# Altium schematic sheet HANDS_FREE_ControlUnit_V2.SchDoc
size A1
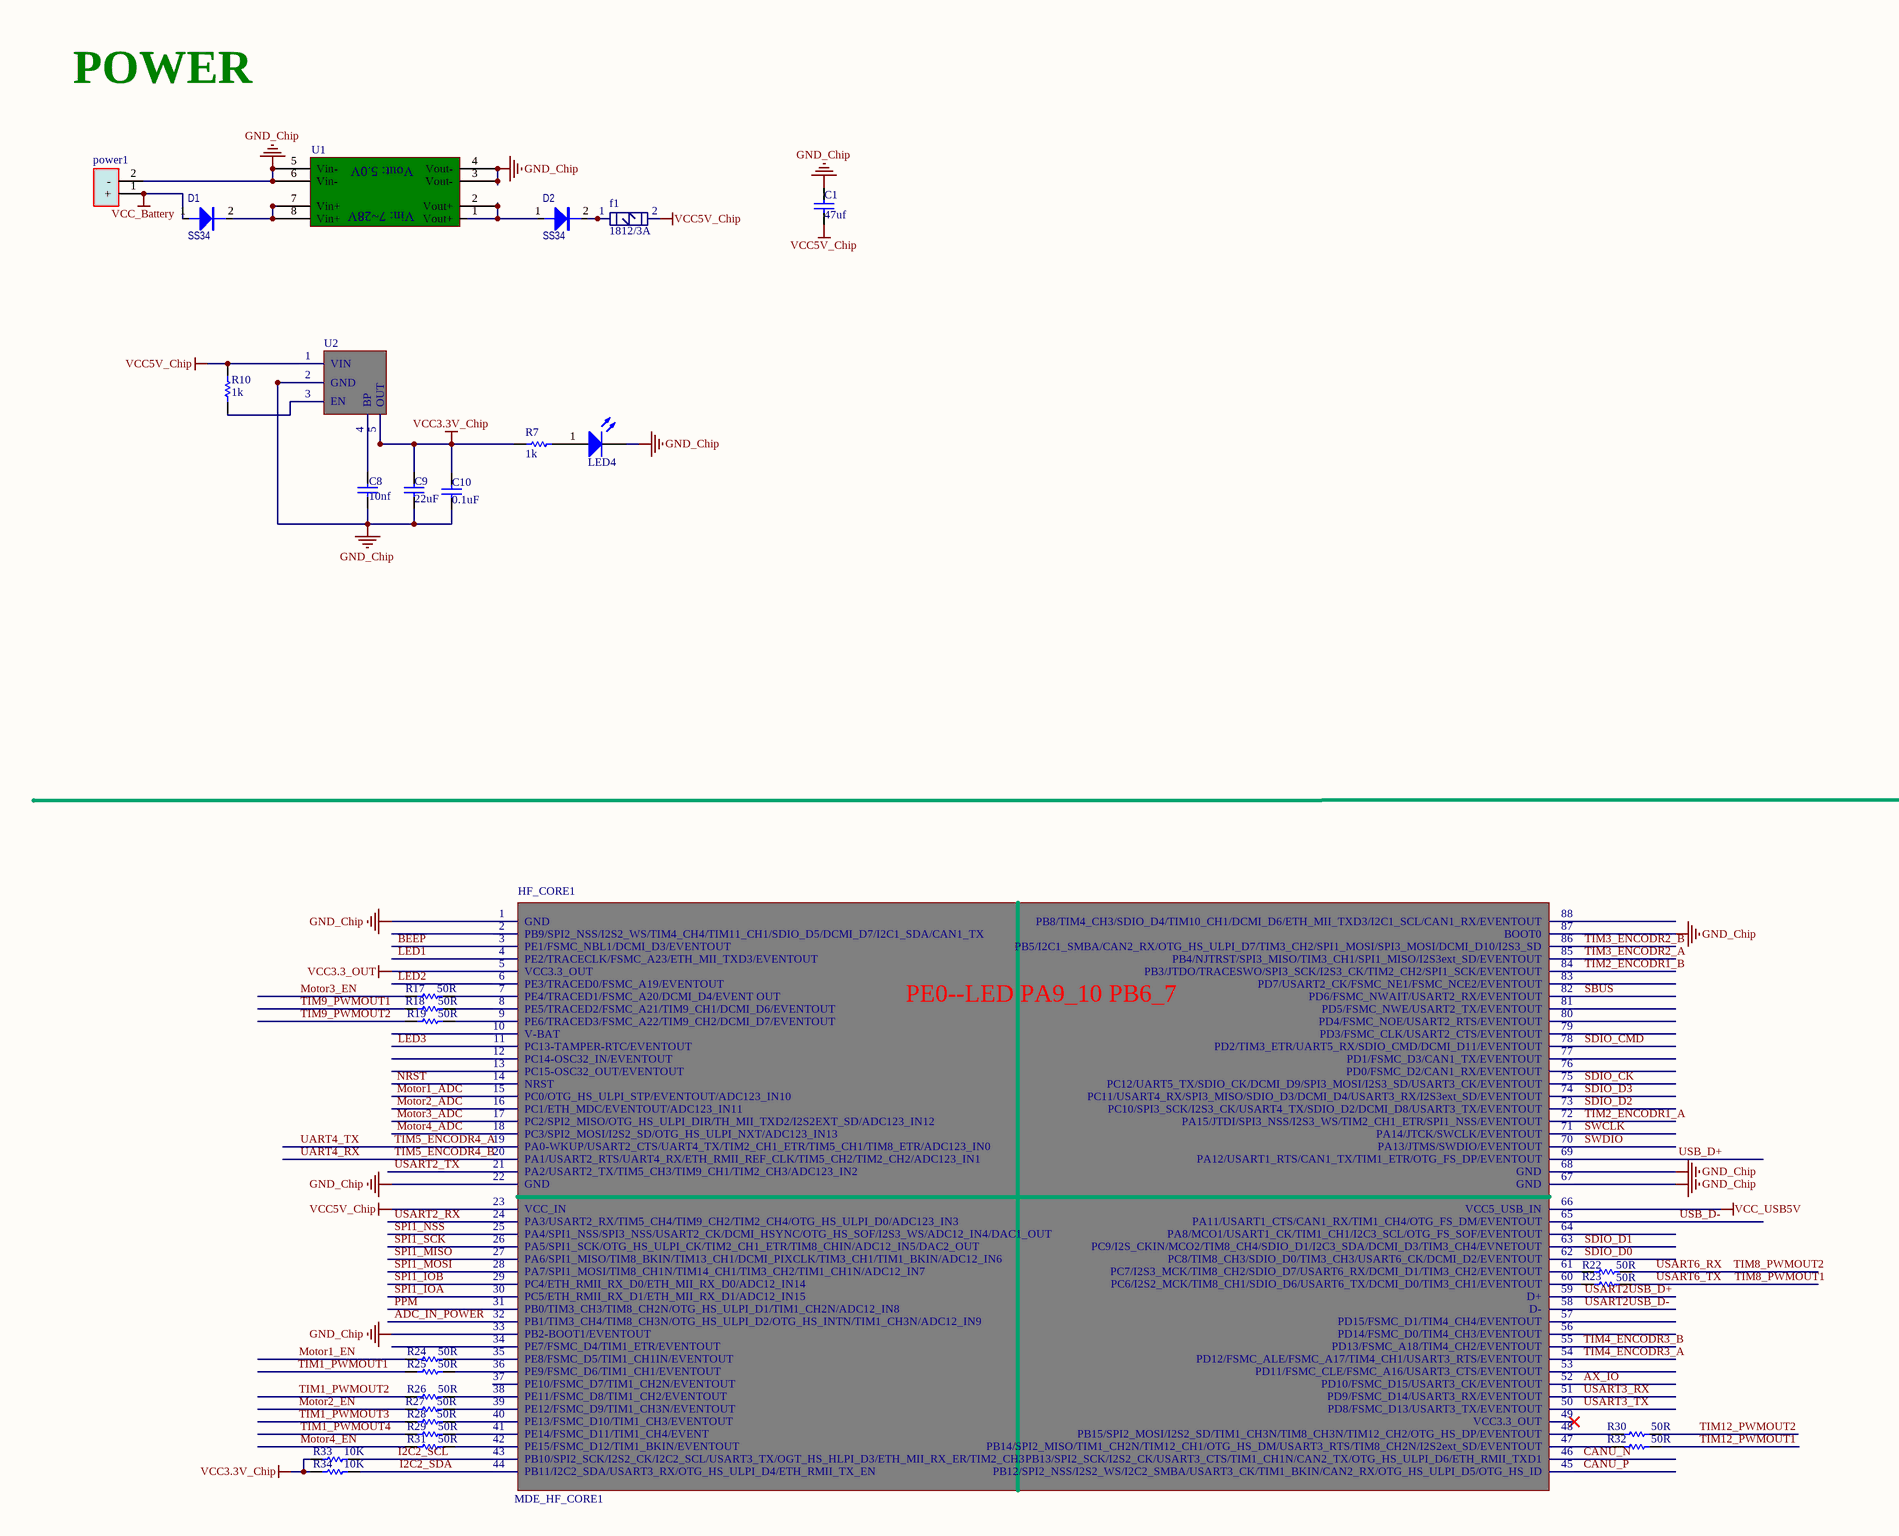
[diagram p0: HANDS_FREE_ControlUnit_V2.SchDoc, top left]
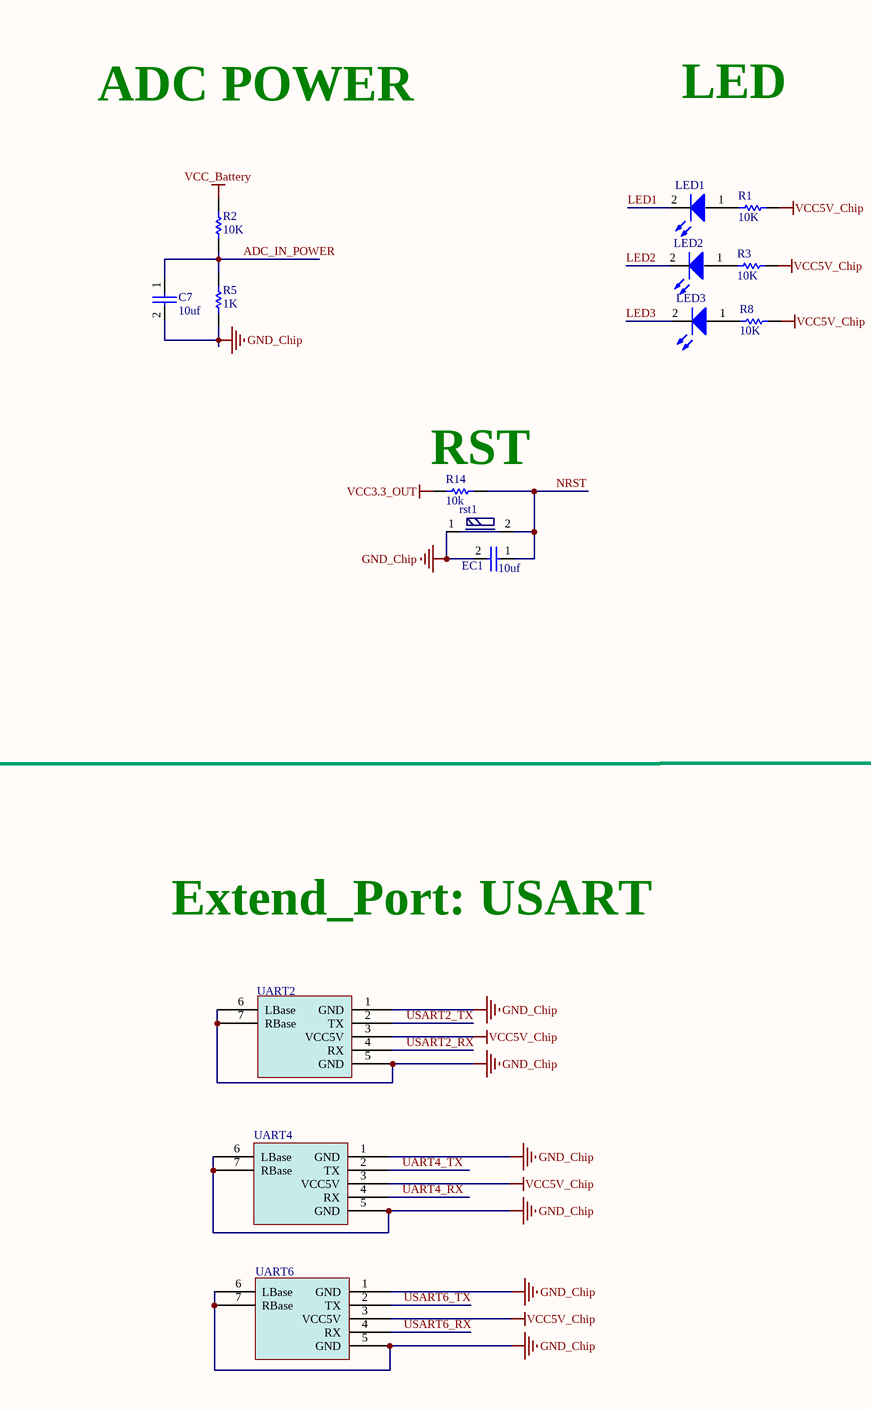
[diagram p1: HANDS_FREE_ControlUnit_V2.SchDoc, top middle]
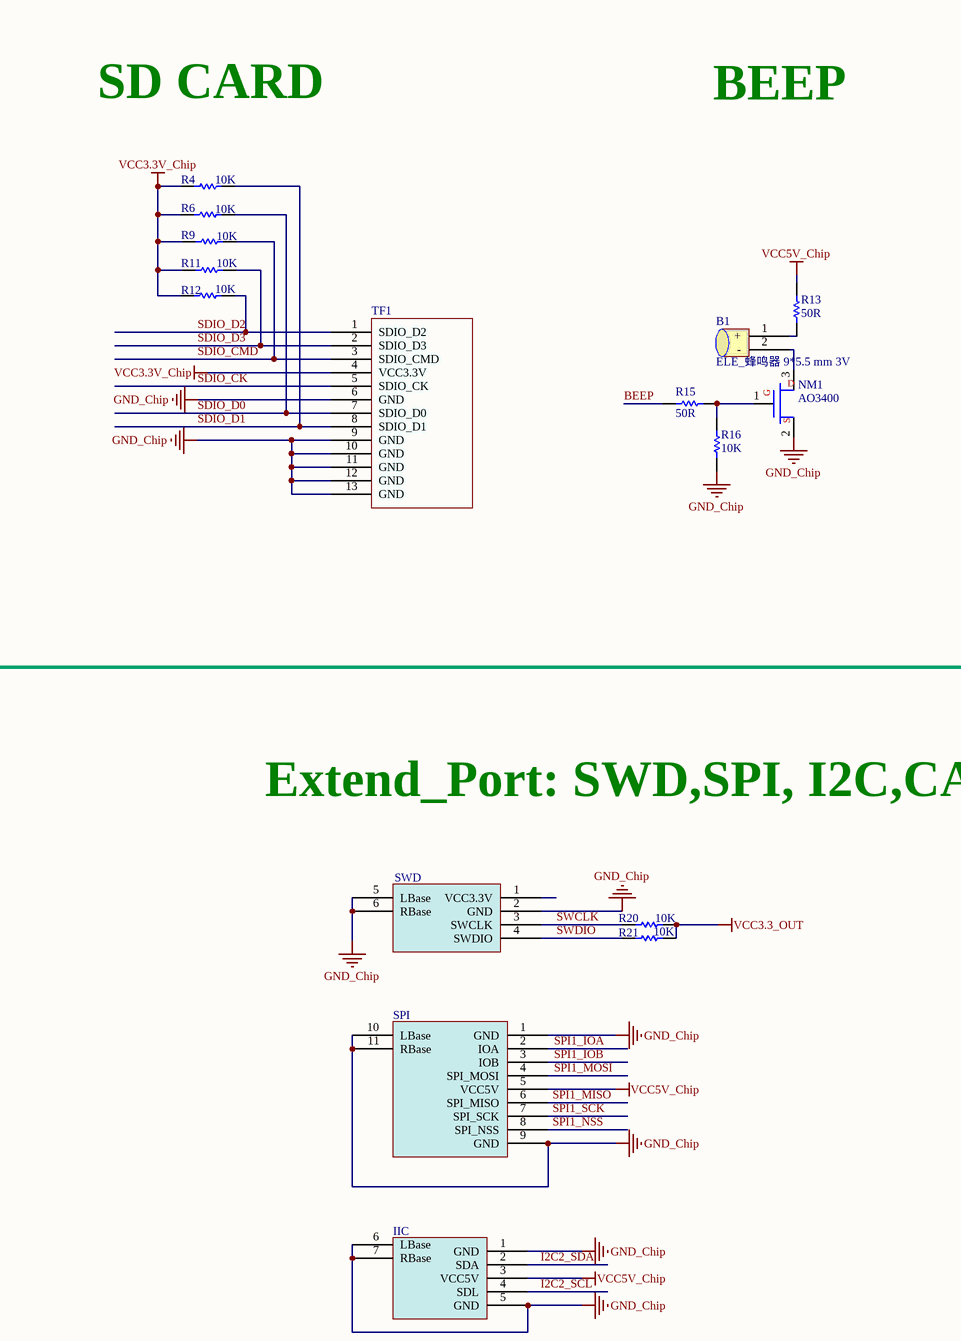
[diagram p2: HANDS_FREE_ControlUnit_V2.SchDoc, top right]
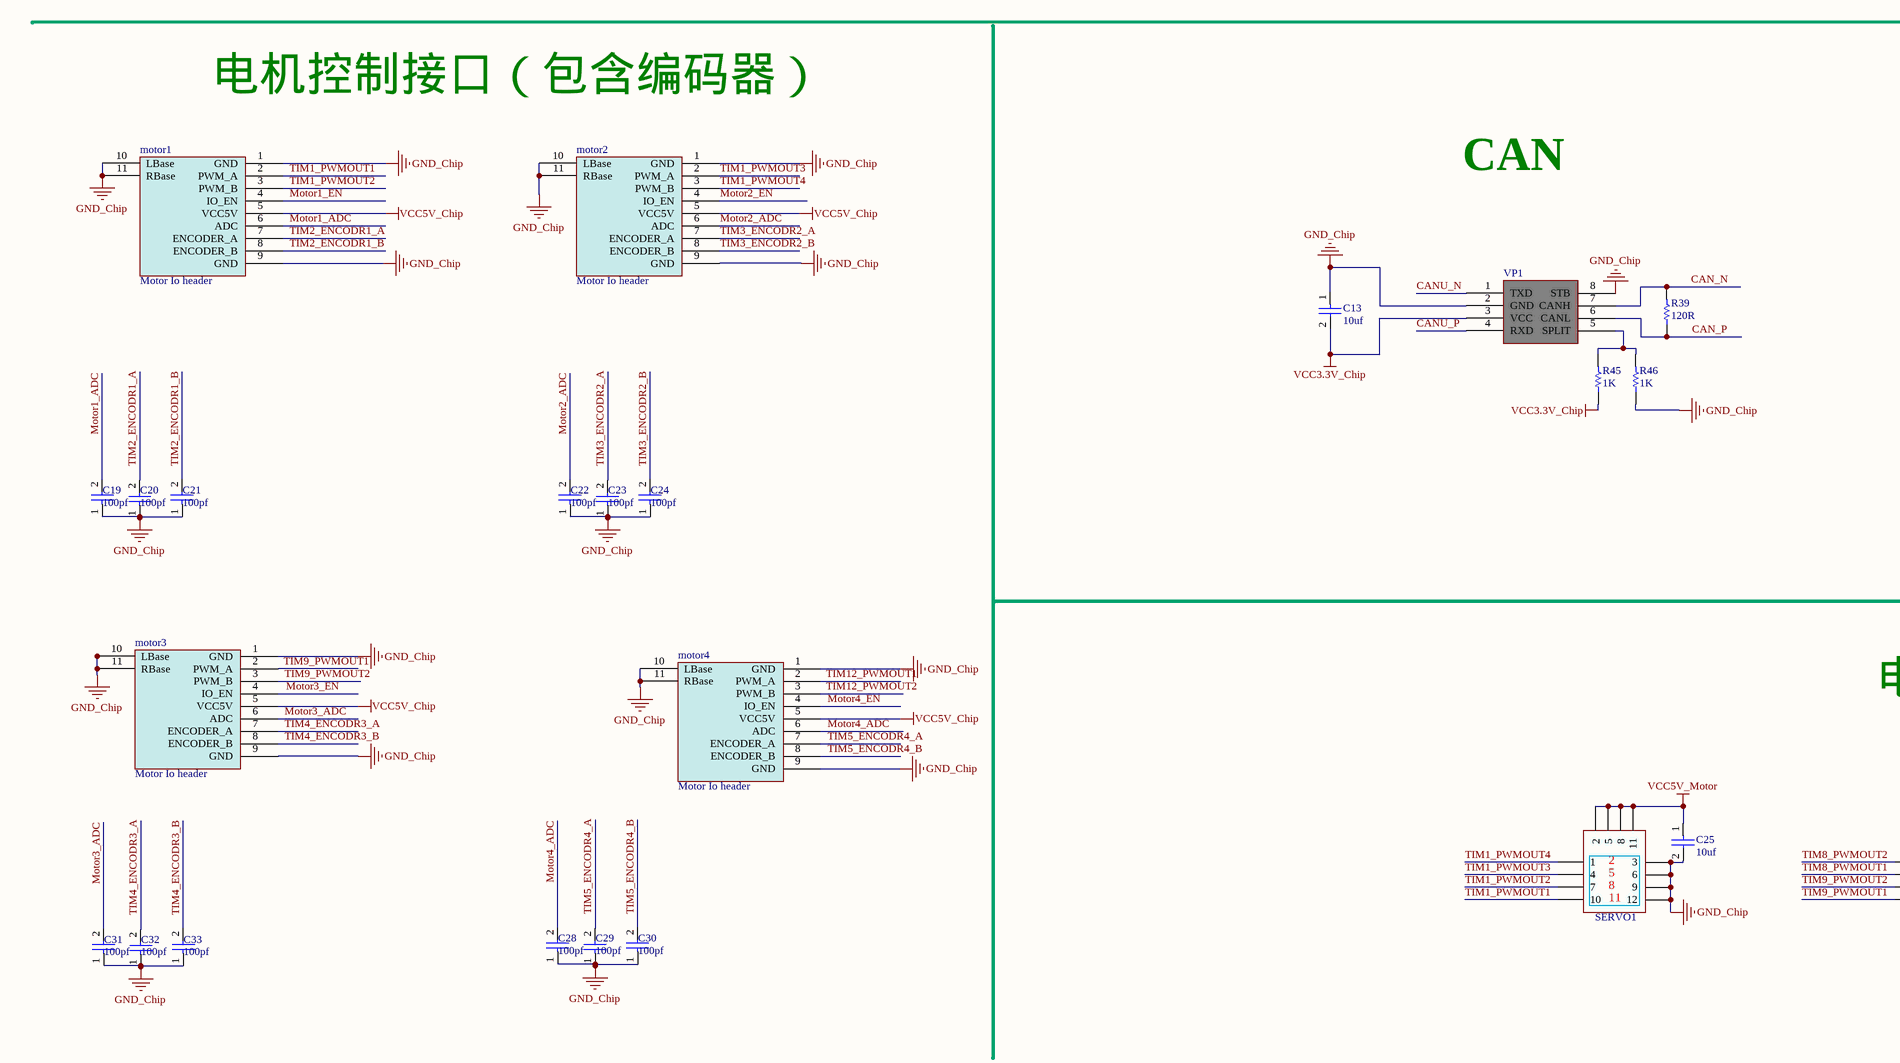
[diagram p3: HANDS_FREE_ControlUnit_V2.SchDoc, bottom left]
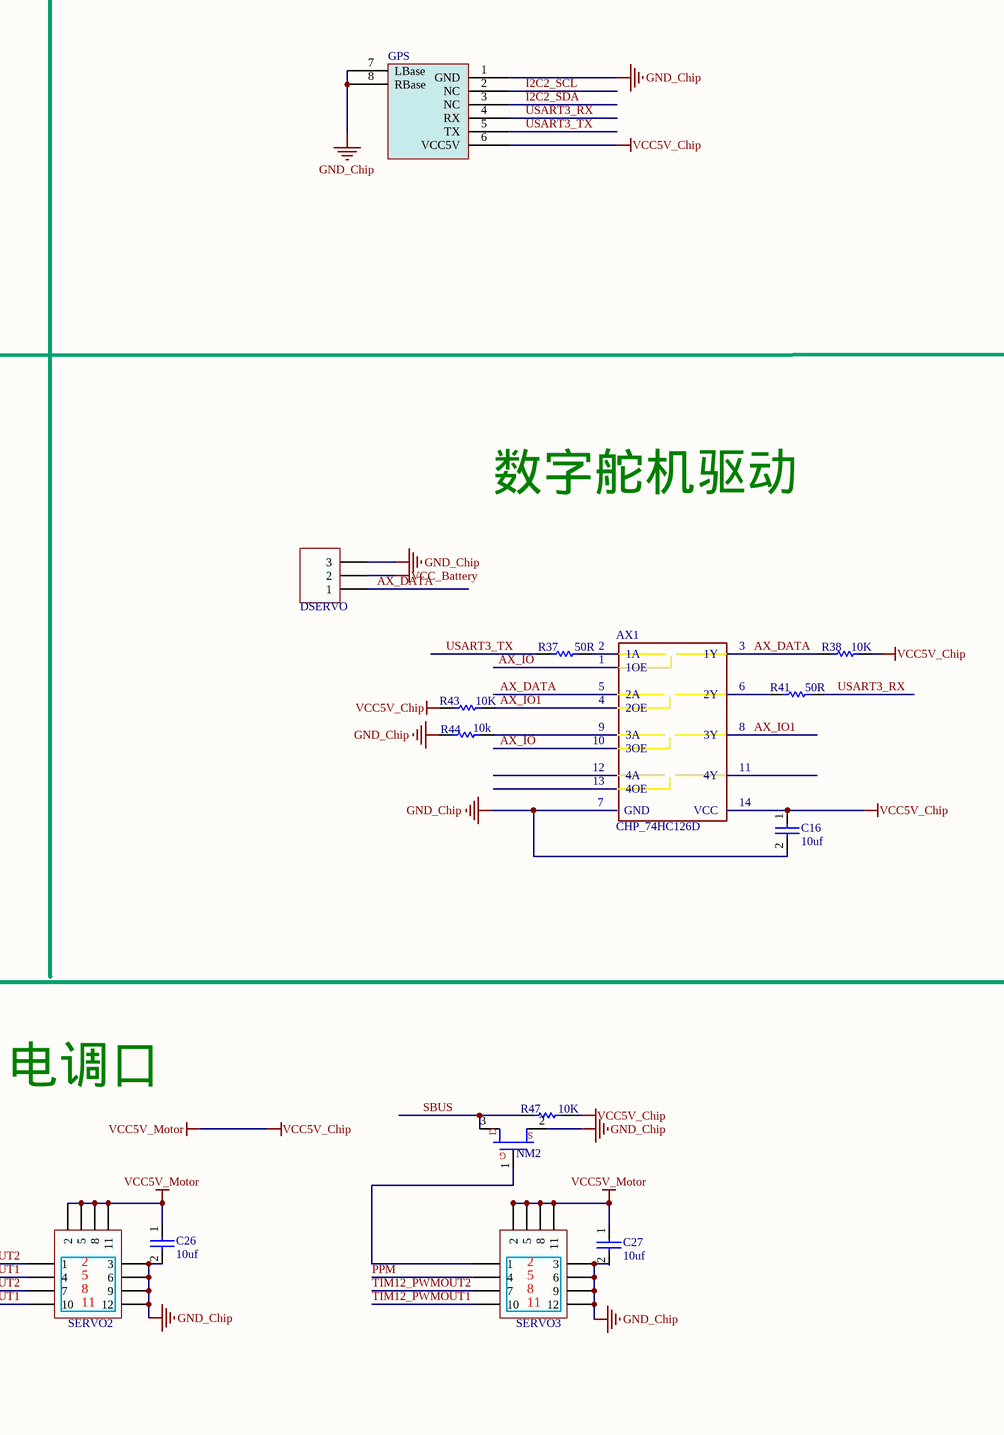
[diagram p4: HANDS_FREE_ControlUnit_V2.SchDoc, bottom middle]
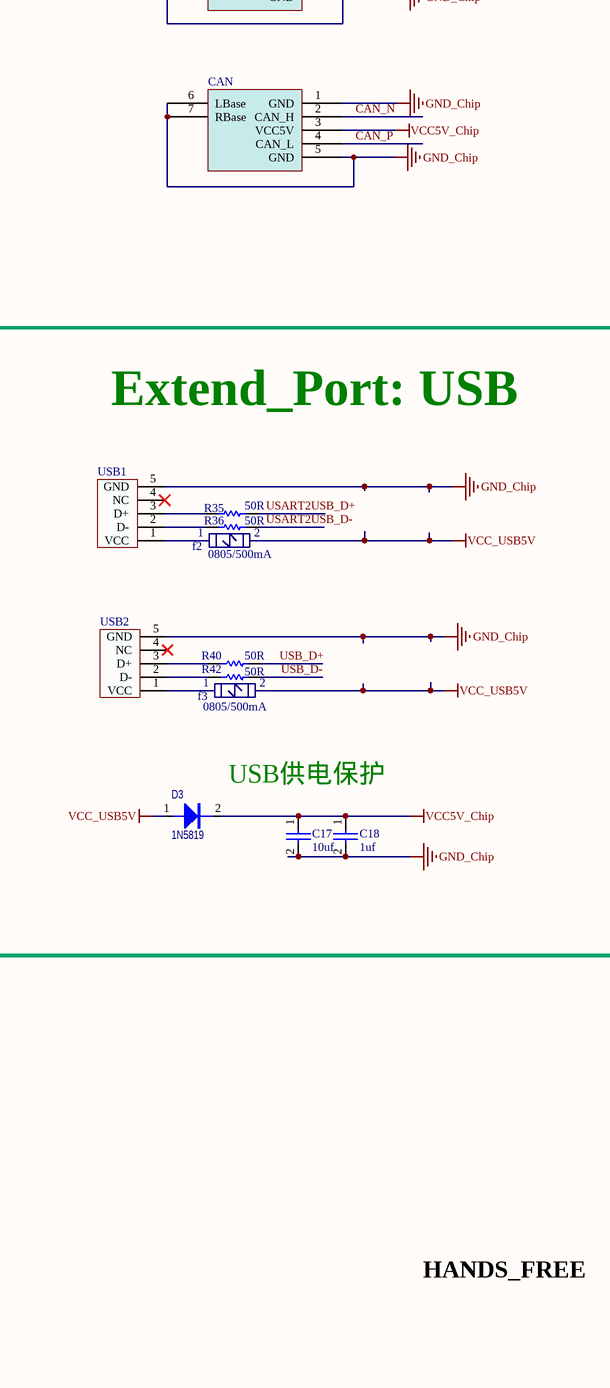
[diagram p5: HANDS_FREE_ControlUnit_V2.SchDoc, bottom right]

## Parts
AX1  CHP_74HC126D  [CHP_SOP_14P]
B1  ELE_蜂鸣器 9*5.5 mm 3V  [ELE_蜂鸣器_D_9*5.5]
C1  47uf  [ELE_1206_P]
C7  10uf  [ELE_0603_P]
C8  10nf  [ELE_0603_P]
C9  22uF  [ELE_0603_P]
C10  0.1uF  [ELE_0603_P]
C13  10uf  [ELE_0603_P]
C16  10uf  [ELE_0603_P]
C17  10uf  [ELE_0603_P]
C18  1uf  [ELE_0603_P]
C19  100pf  [ELE_0603_P]
C20  100pf  [ELE_0603_P]
C21  100pf  [ELE_0603_P]
C22  100pf  [ELE_0603_P]
C23  100pf  [ELE_0603_P]
C24  100pf  [ELE_0603_P]
C25  10uf  [ELE_0603_P]
C26  10uf  [ELE_0603_P]
C27  10uf  [ELE_0603_P]
C28  100pf  [ELE_0603_P]
C29  100pf  [ELE_0603_P]
C30  100pf  [ELE_0603_P]
C31  100pf  [ELE_0603_P]
C32  100pf  [ELE_0603_P]
C33  100pf  [ELE_0603_P]
CAN  HANDS_FREE_IMU  [HDR_Molex_PH_1.25_5P]  (value not drawn)
D1  SS34  [ELE_D1206]
D2  SS34  [ELE_D1206]
D3  1N5819  [ELE_SOD-323]
DSERVO  HDR_Header_1*3  [HDR_数字舵机接口_D]  (value not drawn)
EC1  10uf  [ELE_0603_P]
f1  1812/3A  [ELE_FUZE_1812]
f2  0805/500mA  [ELE_FUZE_0805]
f3  0805/500mA  [ELE_FUZE_0805]
GPS  HANDS_FREE_GPS  [HDR_Molex_PH_1.25_6P]  (value not drawn)
HF_CORE1  MDE_HF_CORE1  [MDE_HF_CORE1]
IIC  HANDS_FREE_IIC  [HDR_Molex_PH_1.25_5P]  (value not drawn)
LED1  ELE_LED  [ELE_0603极性_P]  (value not drawn)
LED2  ELE_LED  [ELE_0603极性_P]  (value not drawn)
LED3  ELE_LED  [ELE_0603极性_P]  (value not drawn)
LED4  Led_sp  [ELE_0603极性_P]  (value not drawn)
motor1  Motor Io header  [HDR_Molex_PH_1.25_9P]
motor2  Motor Io header  [HDR_Molex_PH_1.25_9P]
motor3  Motor Io header  [HDR_Molex_PH_1.25_9P]
motor4  Motor Io header  [HDR_Molex_PH_1.25_9P]
NM1  AO3400  [CHP_SOT23_P_3P]
NM2  AO3400  [CHP_SOT23_P_3P]  (value not drawn)
power1  HDR_Header_Power_2P  [HDR_MOLEX_CANMX3.0_DH_2P]  (value not drawn)
R1  10K  [ELE_0603_P]
R2  10K  [ELE_0603_P]
R3  10K  [ELE_0603_P]
R4  10K  [ELE_0603_P]
R5  1K  [ELE_0603_P]
R6  10K  [ELE_0603_P]
R7  1k  [ELE_0603_P]
R8  10K  [ELE_0603_P]
R9  10K  [ELE_0603_P]
R10  1k  [ELE_0603_P]
R11  10K  [ELE_0603_P]
R12  10K  [ELE_0603_P]
R13  50R  [ELE_0603_P]
R14  10k  [ELE_0603_P]
R15  50R  [ELE_0603_P]
R16  10K  [ELE_0603_P]
R17  50R  [ELE_0603_P]
R18  50R  [ELE_0603_P]
R19  50R  [ELE_0603_P]
R20  10K  [ELE_0603_P]
R21  10K  [ELE_0603_P]
R22  50R  [ELE_0603_P]
R23  50R  [ELE_0603_P]
R24  50R  [ELE_0603_P]
R25  50R  [ELE_0603_P]
R26  50R  [ELE_0603_P]
R27  50R  [ELE_0603_P]
R28  50R  [ELE_0603_P]
R29  50R  [ELE_0603_P]
R30  50R  [ELE_0603_P]
R31  50R  [ELE_0603_P]
R32  50R  [ELE_0603_P]
R33  10K  [ELE_0603_P]
R34  10K  [ELE_0603_P]
R35  50R  [ELE_0603_P]
R36  50R  [ELE_0603_P]
R37  50R  [ELE_0603_P]
R38  10K  [ELE_0603_P]
R39  120R  [ELE_0603_P]
R40  50R  [ELE_0603_P]
R41  50R  [ELE_0603_P]
R42  50R  [ELE_0603_P]
R43  10K  [ELE_0603_P]
R44  10k  [ELE_0603_P]
R45  1K  [ELE_0603_P]
R46  1K  [ELE_0603_P]
R47  10K  [ELE_0603_P]
rst1  ELE_KEY_1  [ELE_KEY_P]  (value not drawn)
SERVO1  HDR_Header_4*3  [HDR_Header_2.54/3.0_DV_3*4]  (value not drawn)
SERVO2  HDR_Header_4*3  [HDR_Header_2.54/3.0_DV_3*4]  (value not drawn)
SERVO3  HDR_Header_4*3  [HDR_Header_2.54/3.0_DV_3*4]  (value not drawn)
SPI  HANDS_FREE_SPI  [HDR_Molex_PH_1.25_9P]  (value not drawn)
SWD  HANDS_FREE_SWD  [HDR_Molex_PH_1.25_4P]  (value not drawn)
TF1  HDR_MicroTFCARD  [HDR_TFCARD_P]  (value not drawn)
U1  MDE_DM02-5.0  [MDE_DM02-5.0]  (value not drawn)
U2  (no value)  [CHP_SOT23_P_5P]
UART2  HANDS_FREE_USART  [HDR_Molex_PH_1.25_5P]  (value not drawn)
UART4  HANDS_FREE_USART  [HDR_Molex_PH_1.25_5P]  (value not drawn)
UART6  HANDS_FREE_USART  [HDR_Molex_PH_1.25_5P]  (value not drawn)
USB1  USBMICRO  [HDR_USB_Micro2]  (value not drawn)
USB2  USBMICRO  [HDR_USB_Micro2]  (value not drawn)
VP1  CHP_VP230_P  [CHP_VP230_P]  (value not drawn)

## Nets
GND_Chip: AX1.7(GND) C1.1 C7.2 C8.1 C9.2 C10.2 C13.1 C16.2 C17.2 C18.2 C19.1 C20.1 C21.1 C22.1 C23.1 C24.1 C25.2 C26.2 C27.2 C28.1 C29.1 C30.1 C31.1 C32.1 C33.1 CAN.1(GND) CAN.5(GND) CAN.6(LBase) CAN.7(RBase) DSERVO.3 EC1.2 GPS.1(GND) GPS.7(LBase) GPS.8(RBase) HF_CORE1.1(GND) HF_CORE1.22(GND) HF_CORE1.33(PB2-BOOT1/EVENTOUT) HF_CORE1.67(GND) HF_CORE1.68(GND) HF_CORE1.87(BOOT0) IIC.1(GND) IIC.5(GND) IIC.6(LBase) IIC.7(RBase) LED4.2(K) motor1.1(GND) motor1.9(GND) motor1.10(LBase) motor1.11(RBase) motor2.1(GND) motor2.9(GND) motor2.10(LBase) motor2.11(RBase) motor3.1(GND) motor3.9(GND) motor3.10(LBase) motor3.11(RBase) motor4.1(GND) motor4.9(GND) motor4.10(LBase) motor4.11(RBase) NM1.2(S) NM2.2(S) power1.2(-) R5.2 R16.1 R44.2 R46.2 rst1.1 SERVO1.3 SERVO1.6 SERVO1.9 SERVO1.12 SERVO2.3 SERVO2.6 SERVO2.9 SERVO2.12 SERVO3.3 SERVO3.6 SERVO3.9 SERVO3.12 SPI.1(GND) SPI.9(GND) SPI.10(LBase) SPI.11(RBase) SWD.2(GND) SWD.5(LBase) SWD.6(RBase) TF1.6(GND) TF1.9(GND) TF1.10(GND) TF1.11(GND) TF1.12(GND) TF1.13(GND) U1.3(Vout-) U1.4(Vout-) U1.5(Vin-) U1.6(Vin-) U2.2(GND) UART2.1(GND) UART2.5(GND) UART2.6(LBase) UART2.7(RBase) UART4.1(GND) UART4.5(GND) UART4.6(LBase) UART4.7(RBase) UART6.1(GND) UART6.5(GND) UART6.6(LBase) UART6.7(RBase) USB1.5(GND) USB2.5(GND) VP1.2(GND) VP1.8(STB)
VCC3.3_OUT: HF_CORE1.5(VCC3.3_OUT) R14.1 R20.1 R21.1
VCC3.3V_Chip: C9.1 C10.1 C13.2 R4.2 R6.2 R7.1 R9.2 R11.2 R12.2 R33.2 R34.2 R45.2 TF1.4(VCC3.3V) U2.5(OUT) VP1.3(VCC)
VCC5V_Chip: AX1.14(VCC) C1.2 C16.1 C17.1 C18.1 C25.1 C26.1 C27.1 CAN.3(VCC5V) D3.2 f1.2 GPS.6(VCC5V) HF_CORE1.23(VCC_IN) IIC.3(VCC5V) motor1.5(VCC5V) motor2.5(VCC5V) motor3.5(VCC5V) motor4.5(VCC5V) R1.1 R3.1 R8.1 R10.1 R13.1 R38.1 R43.2 R47.1 SERVO1.2 SERVO1.5 SERVO1.8 SERVO1.11 SERVO2.2 SERVO2.5 SERVO2.8 SERVO2.11 SERVO3.2 SERVO3.5 SERVO3.8 SERVO3.11 SPI.5(VCC5V) U2.1(VIN) UART2.3(VCC5V) UART4.3(VCC5V) UART6.3(VCC5V)  [also labelled VCC5V_Motor]
VCC_Battery: D1.1 DSERVO.2 power1.1(+) R2.1
VCC_USB5V: D3.1 f2.2 f3.2 HF_CORE1.66(VCC5_USB_IN)
ADC_IN_POWER: C7.1 HF_CORE1.32(PB1/TIM3_CH4/TIM8_CH3N/OTG_HS_ULPI_D2/OTG_HS_INTN/TIM1_CH3N/ADC12_IN9) R2.2 R5.1
AX_DATA: AX1.3(1Y) AX1.5(2A) DSERVO.1 R38.2
AX_IO: AX1.1(1OE) AX1.10(3OE) HF_CORE1.52(PD10/FSMC_D15/USART3_CK/EVENTOUT)
AX_IO1: AX1.4(2OE) AX1.8(3Y) R43.1
BEEP: HF_CORE1.3(PE1/FSMC_NBL1/DCMI_D3/EVENTOUT) R15.2
CAN_N: CAN.2(CAN_H) R39.1 VP1.7(CANH)
CAN_P: CAN.4(CAN_L) R39.2 VP1.6(CANL)
CANU_N: HF_CORE1.46(PB13/SPI2_SCK/I2S2_CK/USART3_CTS/TIM1_CH1N/CAN2_TX/OTG_HS_ULPI_D6/ETH_RMII_TXD1) VP1.1(TXD)
CANU_P: HF_CORE1.45(PB12/SPI2_NSS/I2S2_WS/I2C2_SMBA/USART3_CK/TIM1_BKIN/CAN2_RX/OTG_HS_ULPI_D5/OTG_HS_ID) VP1.4(RXD)
I2C2_SCL: GPS.2(NC) HF_CORE1.43(PB10/SPI2_SCK/I2S2_CK/I2C2_SCL/USART3_TX/OGT_HS_HLPI_D3/ETH_MII_RX_ER/TIM2_CH3) IIC.4(SDL) R33.1
I2C2_SDA: GPS.3(NC) HF_CORE1.44(PB11/I2C2_SDA/USART3_RX/OTG_HS_ULPI_D4/ETH_RMII_TX_EN) IIC.2(SDA) R34.1
LED1: HF_CORE1.4(PE2/TRACECLK/FSMC_A23/ETH_MII_TXD3/EVENTOUT) LED1.2
LED2: HF_CORE1.6(PE3/TRACED0/FSMC_A19/EVENTOUT) LED2.2
LED3: HF_CORE1.11(PC13-TAMPER-RTC/EVENTOUT) LED3.2
Motor1_ADC: C19.2 HF_CORE1.15(PC0/OTG_HS_ULPI_STP/EVENTOUT/ADC123_IN10) motor1.6(ADC)
Motor1_EN: motor1.4(IO_EN) R24.2
Motor2_ADC: C22.2 HF_CORE1.16(PC1/ETH_MDC/EVENTOUT/ADC123_IN11) motor2.6(ADC)
Motor2_EN: motor2.4(IO_EN) R27.2
Motor3_ADC: C31.2 HF_CORE1.17(PC2/SPI2_MISO/OTG_HS_ULPI_DIR/TH_MII_TXD2/I2S2EXT_SD/ADC123_IN12) motor3.6(ADC)
Motor3_EN: motor3.4(IO_EN) R17.2
Motor4_ADC: C28.2 HF_CORE1.18(PC3/SPI2_MOSI/I2S2_SD/OTG_HS_ULPI_NXT/ADC123_IN13) motor4.6(ADC)
Motor4_EN: motor4.4(IO_EN) R31.2
NRST: EC1.1 HF_CORE1.14(NRST) R14.2 rst1.2
PPM: HF_CORE1.31(PB0/TIM3_CH3/TIM8_CH2N/OTG_HS_ULPI_D1/TIM1_CH2N/ADC12_IN8) SERVO3.4
SBUS: HF_CORE1.82(PD6/FSMC_NWAIT/USART2_RX/EVENTOUT) NM2.3(D) R47.2
SDIO_CK: HF_CORE1.75(PC12/UART5_TX/SDIO_CK/DCMI_D9/SPI3_MOSI/I2S3_SD/USART3_CK/EVENTOUT) TF1.5(SDIO_CK)
SDIO_CMD: HF_CORE1.78(PD2/TIM3_ETR/UART5_RX/SDIO_CMD/DCMI_D11/EVENTOUT) R9.1 TF1.3(SDIO_CMD)
SDIO_D0: HF_CORE1.62(PC8/TIM8_CH3/SDIO_D0/TIM3_CH3/USART6_CK/DCMI_D2/EVENTOUT) R6.1 TF1.7(SDIO_D0)
SDIO_D1: HF_CORE1.63(PC9/I2S_CKIN/MCO2/TIM8_CH4/SDIO_D1/I2C3_SDA/DCMI_D3/TIM3_CH4/EVNETOUT) R4.1 TF1.8(SDIO_D1)
SDIO_D2: HF_CORE1.73(PC10/SPI3_SCK/I2S3_CK/USART4_TX/SDIO_D2/DCMI_D8/USART3_TX/EVENTOUT) R12.1 TF1.1(SDIO_D2)
SDIO_D3: HF_CORE1.74(PC11/USART4_RX/SPI3_MISO/SDIO_D3/DCMI_D4/USART3_RX/I2S3ext_SD/EVENTOUT) R11.1 TF1.2(SDIO_D3)
SPI1_IOA: HF_CORE1.30(PC5/ETH_RMII_RX_D1/ETH_MII_RX_D1/ADC12_IN15) SPI.2(IOA)
SPI1_IOB: HF_CORE1.29(PC4/ETH_RMII_RX_D0/ETH_MII_RX_D0/ADC12_IN14) SPI.3(IOB)
SPI1_MISO: HF_CORE1.27(PA6/SPI1_MISO/TIM8_BKIN/TIM13_CH1/DCMI_PIXCLK/TIM3_CH1/TIM1_BKIN/ADC12_IN6) SPI.6(SPI_MISO)
SPI1_MOSI: HF_CORE1.28(PA7/SPI1_MOSI/TIM8_CH1N/TIM14_CH1/TIM3_CH2/TIM1_CH1N/ADC12_IN7) SPI.4(SPI_MOSI)
SPI1_NSS: HF_CORE1.25(PA4/SPI1_NSS/SPI3_NSS/USART2_CK/DCMI_HSYNC/OTG_HS_SOF/I2S3_WS/ADC12_IN4/DAC1_OUT) SPI.8(SPI_NSS)
SPI1_SCK: HF_CORE1.26(PA5/SPI1_SCK/OTG_HS_ULPI_CK/TIM2_CH1_ETR/TIM8_CHIN/ADC12_IN5/DAC2_OUT) SPI.7(SPI_SCK)
SWCLK: HF_CORE1.71(PA14/JTCK/SWCLK/EVENTOUT) R20.2 SWD.3(SWCLK)
SWDIO: HF_CORE1.70(PA13/JTMS/SWDIO/EVENTOUT) R21.2 SWD.4(SWDIO)
TIM1_PWMOUT1: motor1.2(PWM_A) R25.2 SERVO1.10
TIM1_PWMOUT2: motor1.3(PWM_B) R26.2 SERVO1.7
TIM1_PWMOUT3: motor2.2(PWM_A) R28.2 SERVO1.4
TIM1_PWMOUT4: motor2.3(PWM_B) R29.2 SERVO1.1
TIM2_ENCODR1_A: C20.2 HF_CORE1.72(PA15/JTDI/SPI3_NSS/I2S3_WS/TIM2_CH1_ETR/SPI1_NSS/EVENTOUT) motor1.7(ENCODER_A)
TIM2_ENCODR1_B: C21.2 HF_CORE1.84(PB3/JTDO/TRACESWO/SPI3_SCK/I2S3_CK/TIM2_CH2/SPI1_SCK/EVENTOUT) motor1.8(ENCODER_B)
TIM3_ENCODR2_A: C23.2 HF_CORE1.85(PB4/NJTRST/SPI3_MISO/TIM3_CH1/SPI1_MISO/I2S3ext_SD/EVENTOUT) motor2.7(ENCODER_A)
TIM3_ENCODR2_B: C24.2 HF_CORE1.86(PB5/I2C1_SMBA/CAN2_RX/OTG_HS_ULPI_D7/TIM3_CH2/SPI1_MOSI/SPI3_MOSI/DCMI_D10/I2S3_SD) motor2.8(ENCODER_B)
TIM4_ENCODR3_A: C32.2 HF_CORE1.54(PD12/FSMC_ALE/FSMC_A17/TIM4_CH1/USART3_RTS/EVENTOUT) motor3.7(ENCODER_A)
TIM4_ENCODR3_B: C33.2 HF_CORE1.55(PD13/FSMC_A18/TIM4_CH2/EVENTOUT) motor3.8(ENCODER_B)
TIM5_ENCODR4_A: C29.2 HF_CORE1.19(PA0-WKUP/USART2_CTS/UART4_TX/TIM2_CH1_ETR/TIM5_CH1/TIM8_ETR/ADC123_IN0) motor4.7(ENCODER_A) UART4.2(TX)  [also labelled UART4_TX]
TIM5_ENCODR4_B: C30.2 HF_CORE1.20(PA1/USART2_RTS/UART4_RX/ETH_RMII_REF_CLK/TIM5_CH2/TIM2_CH2/ADC123_IN1) motor4.8(ENCODER_B) UART4.4(RX)  [also labelled UART4_RX]
TIM8_PWMOUT1: R23.1 SERVO2.4 UART6.2(TX)  [also labelled USART6_TX]
TIM8_PWMOUT2: R22.1 SERVO2.1 UART6.4(RX)  [also labelled USART6_RX]
TIM9_PWMOUT1: motor3.2(PWM_A) R18.2 SERVO2.10
TIM9_PWMOUT2: motor3.3(PWM_B) R19.2 SERVO2.7
TIM12_PWMOUT1: motor4.2(PWM_A) R32.1 SERVO3.10
TIM12_PWMOUT2: motor4.3(PWM_B) R30.1 SERVO3.7
USART2_RX: HF_CORE1.24(PA3/USART2_RX/TIM5_CH4/TIM9_CH2/TIM2_CH4/OTG_HS_ULPI_D0/ADC123_IN3) UART2.4(RX)
USART2_TX: HF_CORE1.21(PA2/USART2_TX/TIM5_CH3/TIM9_CH1/TIM2_CH3/ADC123_IN2) UART2.2(TX)
USART2USB_D+: HF_CORE1.59(D+) R35.1
USART2USB_D-: HF_CORE1.58(D-) R36.1
USART3_RX: GPS.4(RX) HF_CORE1.51(PD9/FSMC_D14/USART3_RX/EVENTOUT) R41.1
USART3_TX: GPS.5(TX) HF_CORE1.50(PD8/FSMC_D13/USART3_TX/EVENTOUT) R37.2
USB_D+: HF_CORE1.69(PA12/USART1_RTS/CAN1_TX/TIM1_ETR/OTG_FS_DP/EVENTOUT) R40.1
USB_D-: HF_CORE1.65(PA11/USART1_CTS/CAN1_RX/TIM1_CH4/OTG_FS_DM/EVENTOUT) R42.1
NetAX1_2: AX1.2(1A) R37.1
NetAX1_6: AX1.6(2Y) R41.2
NetAX1_9: AX1.9(3A) R44.1
NetB1_1: B1.1(+) R13.2
NetB1_2: B1.2(-) NM1.3(D)
NetC8_2: C8.2 U2.4(BP)
NetD1_2: D1.2 U1.7(Vin+) U1.8(Vin+)
NetD2_1: D2.1 U1.1(Vout+) U1.2(Vout+)
NetD2_2: D2.2 f1.1
Netf2_1: f2.1 USB1.1(VCC)
Netf3_1: f3.1 USB2.1(VCC)
NetHF_CORE1_7: HF_CORE1.7(PE4/TRACED1/FSMC_A20/DCMI_D4/EVENT_OUT) R17.1
NetHF_CORE1_8: HF_CORE1.8(PE5/TRACED2/FSMC_A21/TIM9_CH1/DCMI_D6/EVENTOUT) R18.1
NetHF_CORE1_9: HF_CORE1.9(PE6/TRACED3/FSMC_A22/TIM9_CH2/DCMI_D7/EVENTOUT) R19.1
NetHF_CORE1_35: HF_CORE1.35(PE8/FSMC_D5/TIM1_CH1IN/EVENTOUT) R24.1
NetHF_CORE1_36: HF_CORE1.36(PE9/FSMC_D6/TIM1_CH1/EVENTOUT) R25.1
NetHF_CORE1_38: HF_CORE1.38(PE11/FSMC_D8/TIM1_CH2/EVENTOUT) R26.1
NetHF_CORE1_39: HF_CORE1.39(PE12/FSMC_D9/TIM1_CH3N/EVENTOUT) R27.1
NetHF_CORE1_40: HF_CORE1.40(PE13/FSMC_D10/TIM1_CH3/EVENTOUT) R28.1
NetHF_CORE1_41: HF_CORE1.41(PE14/FSMC_D11/TIM1_CH4/EVENT) R29.1
NetHF_CORE1_42: HF_CORE1.42(PE15/FSMC_D12/TIM1_BKIN/EVENTOUT) R31.1
NetHF_CORE1_47: HF_CORE1.47(PB14/SPI2_MISO/TIM1_CH2N/TIM12_CH1/OTG_HS_DM/USART3_RTS/TIM8_CH2N/I2S2ext_SD/EVENTOUT) R32.2
NetHF_CORE1_48: HF_CORE1.48(PB15/SPI2_MOSI/I2S2_SD/TIM1_CH3N/TIM8_CH3N/TIM12_CH2/OTG_HS_DP/EVENTOUT) R30.2
NetHF_CORE1_60: HF_CORE1.60(PC6/I2S2_MCK/TIM8_CH1/SDIO_D6/USART6_TX/DCMI_D0/TIM3_CH1/EVENTOUT) R23.2
NetHF_CORE1_61: HF_CORE1.61(PC7/I2S3_MCK/TIM8_CH2/SDIO_D7/USART6_RX/DCMI_D1/TIM3_CH2/EVENTOUT) R22.2
NetLED1_1: LED1.1 R1.2
NetLED2_1: LED2.1 R3.2
NetLED3_1: LED3.1 R8.2
NetLED4_1: LED4.1(A) R7.2
NetNM1_1: NM1.1(G) R15.1 R16.2
NetNM2_1: NM2.1(G) SERVO3.1
NetR10_2: R10.2 U2.3(EN)
NetR35_2: R35.2 USB1.3(D+)
NetR36_2: R36.2 USB1.2(D-)
NetR40_2: R40.2 USB2.3(D+)
NetR42_2: R42.2 USB2.2(D-)
NetR45_1: R45.1 R46.1 VP1.5(SPLIT)

Not connected (* = marked no-connect by the designer): AX1 11(4Y) 12(4A) 13(4OE); HF_CORE1 2(PB9/SPI2_NSS/I2S2_WS/TIM4_CH4/TIM11_CH1/SDIO_D5/DCMI_D7/I2C1_SDA/CAN1_TX) 10(V-BAT) 12(PC14-OSC32_IN/EVENTOUT) 13(PC15-OSC32_OUT/EVENTOUT) 34(PE7/FSMC_D4/TIM1_ETR/EVENTOUT) 37(PE10/FSMC_D7/TIM1_CH2N/EVENTOUT) 49(VCC3.3_OUT)* 53(PD11/FSMC_CLE/FSMC_A16/USART3_CTS/EVENTOUT) 56(PD14/FSMC_D0/TIM4_CH3/EVENTOUT) 57(PD15/FSMC_D1/TIM4_CH4/EVENTOUT) 64(PA8/MCO1/USART1_CK/TIM1_CH1/I2C3_SCL/OTG_FS_SOF/EVENTOUT) 76(PD0/FSMC_D2/CAN1_RX/EVENTOUT) 77(PD1/FSMC_D3/CAN1_TX/EVENTOUT) 79(PD3/FSMC_CLK/USART2_CTS/EVENTOUT) 80(PD4/FSMC_NOE/USART2_RTS/EVENTOUT) 81(PD5/FSMC_NWE/USART2_TX/EVENTOUT) 83(PD7/USART2_CK/FSMC_NE1/FSMC_NCE2/EVENTOUT) 88(PB8/TIM4_CH3/SDIO_D4/TIM10_CH1/DCMI_D6/ETH_MII_TXD3/I2C1_SCL/CAN1_RX/EVENTOUT); SWD 1(VCC3.3V); USB1 4(NC)*; USB2 4(NC)*

## Notes on the sheet
- POWER
- ADC POWER
- LED
- SD CARD
- BEEP
- (near R14) RST
- Extend_Port: SWD,SPI, I2C,CAN
- Extend_Port: USART
- 电机控制接口（包含编码器）
- Extend_Port: USB
- CAN
- 数字舵机驱动
- USB供电保护
- 电调口
- HANDS_FREE
- (in symbol MDE_DM02-5.0) Vout: 5.0V; Vin: 7~28V
- (in symbol MDE_HF_CORE1) PE0--LED PA9_10 PB6_7

## Library data of the parts
AX1 = CHP_74HC126D: 4路三态门缓冲器
B1 = ELE_蜂鸣器 9*5.5 mm 3V: 直插 蜂鸣器 9mm
C1 C8-C10 = Cap
C7 C19-C24 C28-C33 EC1 = ELE_Standard_Cap100pf: 贴片 电容100pf 0603
C13 C16 C17 C25-C27 = ELE_Standard_Cap10uf: 贴片 电容10uf 0603
C18 = ELE_Standard_Cap1uf: 贴片 电容1uf 0603
D1 D2 = ELE_Standard_Diode_1206: 贴片 二极管 SS34/SS54
D3 = ELE_Standard_Diode_SOD323: 贴片 二极管 SOD323
f1 = ELE_Standard_Fuze_1812/3A: 贴片保险丝 1812 3A
f2 f3 = ELE_Standard_Fuze_0805/500mA: 贴片保险丝 0805 500mA
HF_CORE1 = MDE_HF_CORE1: HANDS FREE核心板1代
LED1-LED3 = ELE_LED: 发光二极管 0603; Published: 8-Jun-2000; LatestRevisionDate: 17-Jul-2002; LatestRevisionNote: Re-released for DXP Platform.; PackageDocument: Feb-2002; PackageReference: 3.2X1.6X1.1; Publisher: Altium Limited
motor1-motor4 = HANDS_FREE_MOTOR: 卧贴 molex 1.25间距 9P接口
NM1 NM2 = ELE_NMOS_1: 贴片 NMOS管 SOT23; Note: Pin 2 is electrically connected to pin 4.; Published: 8-Jun-2000; LatestRevisionDate: 17-Jul-2002; LatestRevisionNote: Re-released for DXP Platform.; DatasheetDocument: PD-9.814; PackageReference: TO-220AB; Publisher: Altium Limited; Code_JEDEC: TO-220-AB; ComponentLink1Description: Manufacturer Link; ComponentLink1URL: http://www.irf.com/
R1-R3 R8 = ELE_Standard_R1K: 贴片 电阻1K欧 0603
R4-R6 R9 R11-R13 R16 R20 R21 R33 R34 R38 R45-R47 = ELE_Standard_R10K: 贴片 电阻10K欧 0603
R7 R10 R14 R15 R17-R19 R22-R32 R35-R37 R40-R44 = ELE_Standard_R50R: 贴片 电阻50欧 0603
R39 = ELE_Standard_R120R: 贴片 电阻120欧 0603
rst1 = ELE_KEY_1: 贴片 触发开关 2P
SERVO1-SERVO3 = HDR_Header_4*3: 直插 三排排针
U2 = CHP_RT9193: 贴片 RT9193稳压芯片 SOT23_5P 3.3v
USB1 USB2 = HDR_USBMINI
DSERVO = HDR_Header_1*3: LatestRevisionDate: 17-Jul-2002; LatestRevisionNote: Re-released for DXP Platform.; Publisher: Altium Limited